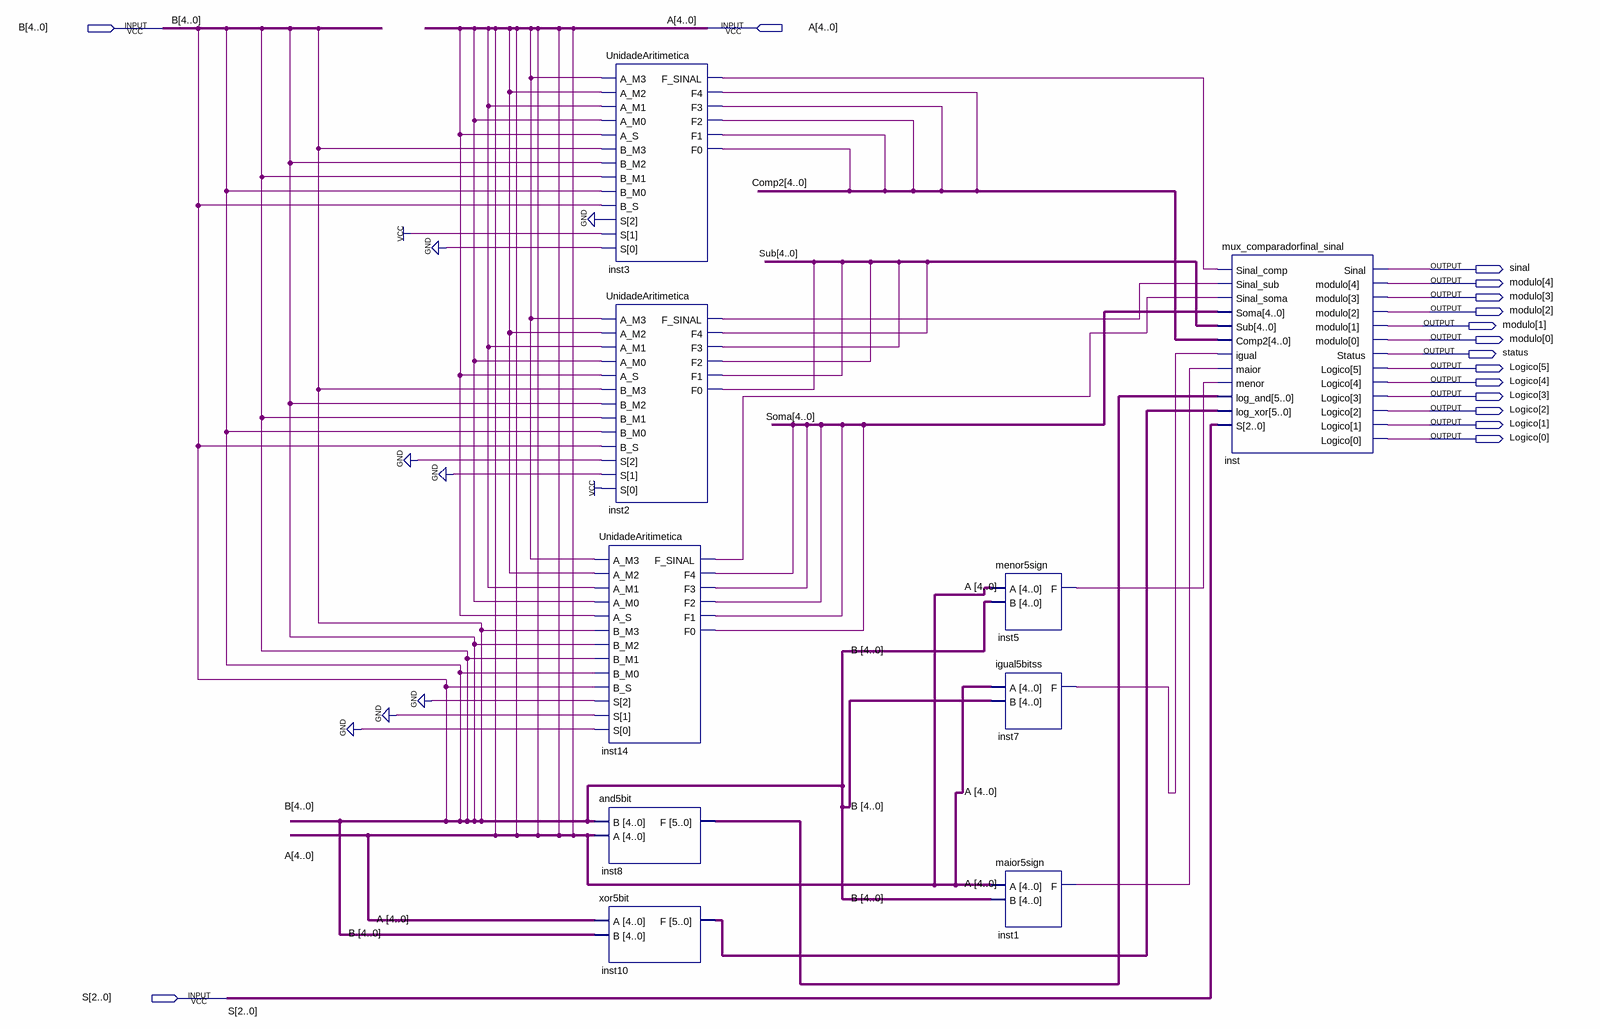
[diagram p0: schematic sheet]
// Quartus schematic ULA.bdf as structural Verilog: 9 symbols, 16 pins
module ULA (
  input  [4:0] B,
  input  [4:0] A,
  input  [2:0] S,
  output sinal,
  output [4:0] modulo,
  output status,
  output [5:0] Logico
);

  wire inst1_f, inst2_f_sinal, inst3_f_sinal, inst5_f, inst7_f, inst14_f_sinal;
  wire [4:0] Comp2, Soma, Sub;
  wire [5:0] log_and, log_xor;

  UnidadeAritimetica inst3 (
    .A_M3(A[3]), .A_M2(A[2]), .A_M1(A[1]), .A_M0(A[0]), .A_S(A[4]), .B_M3(B[3]), .B_M2(B[2]), .B_M1(B[1]),
    .B_M0(B[0]), .B_S(B[4]), .S(3'b010), .F_SINAL(inst3_f_sinal), .F4(Comp2[4]), .F3(Comp2[3]),
    .F2(Comp2[2]), .F1(Comp2[1]), .F0(Comp2[0]));
  UnidadeAritimetica inst2 (
    .A_M3(A[3]), .A_M2(A[2]), .A_M1(A[1]), .A_M0(A[0]), .A_S(A[4]), .B_M3(B[3]), .B_M2(B[2]), .B_M1(B[1]),
    .B_M0(B[0]), .B_S(B[4]), .S(3'b001), .F_SINAL(inst2_f_sinal), .F4(Sub[4]), .F3(Sub[3]), .F2(Sub[2]),
    .F1(Sub[1]), .F0(Sub[0]));
  UnidadeAritimetica inst14 (
    .A_M3(A[3]), .A_M2(A[2]), .A_M1(A[1]), .A_M0(A[0]), .A_S(A[4]), .B_M3(B[3]), .B_M2(B[2]), .B_M1(B[1]),
    .B_M0(B[0]), .B_S(B[4]), .S(3'b000), .F_SINAL(inst14_f_sinal), .F4(Soma[4]), .F3(Soma[3]), .F2(Soma[2]),
    .F1(Soma[1]), .F0(Soma[0]));
  and5bit inst8 (.B(B), .A(A), .F(log_and));
  xor5bit inst10 (.A(A), .B(B), .F(log_xor));
  menor5sign inst5 (.A(A), .B(B), .F(inst5_f));
  igual5bitss inst7 (.A(A), .B(B), .F(inst7_f));
  maior5sign inst1 (.A(A), .B(B), .F(inst1_f));
  mux_comparadorfinal_sinal inst (
    .Sinal_comp(inst3_f_sinal), .Sinal_sub(inst2_f_sinal), .Sinal_soma(inst14_f_sinal), .Soma(Soma),
    .Sub(Sub), .Comp2(Comp2), .igual(inst7_f), .maior(inst1_f), .menor(inst5_f), .log_and(log_and),
    .log_xor(log_xor), .S(S), .Sinal(sinal), .modulo(modulo), .Status(status), .Logico(Logico));
endmodule
